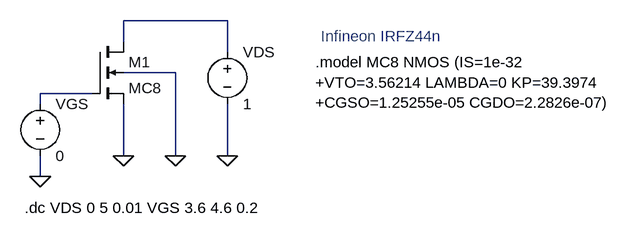
[diagram p0: schematic MOSFET_output.asc]
MOSFET_output.asc, the LTspice schematic file:
Version 4
SHEET 1 1412 680
WIRE 320 80 160 80
WIRE 160 112 160 80
WIRE 320 128 320 80
WIRE 240 160 160 160
WIRE 112 192 32 192
WIRE 32 208 32 192
WIRE 160 288 160 208
WIRE 240 288 240 160
WIRE 320 288 320 208
WIRE 32 320 32 288
FLAG 32 320 0
FLAG 160 288 0
FLAG 320 288 0
FLAG 240 288 0
SYMBOL voltage 32 192 R0
WINDOW 123 0 0 Left 0
WINDOW 39 0 0 Left 0
SYMATTR InstName VGS
SYMATTR Value 0
SYMBOL voltage 320 112 R0
WINDOW 123 0 0 Left 0
WINDOW 39 0 0 Left 0
SYMATTR InstName VDS
SYMATTR Value 1
SYMBOL nmos4 112 112 R0
SYMATTR InstName M1
SYMATTR Value MC8
TEXT 8 368 Left 2 !.dc VDS 0 5 0.01 VGS 3.6 4.6 0.2
TEXT 456 144 Left 2 !.model MC8 NMOS (IS=1e-32\n+VTO=3.56214 LAMBDA=0 KP=39.3974\n+CGSO=1.25255e-05 CGDO=2.2826e-07)
TEXT 464 104 Left 2 ;Infineon IRFZ44n

The netlist it stands for:
* MOSFET_output.asc
VGS N002 0 0
VDS N001 0 1
M1 N001 N002 0 0 MC8
.model NMOS NMOS
.model PMOS PMOS
.lib standard.mos
.dc VDS 0 5 0.01 VGS 3.6 4.6 0.2
.model MC8 NMOS (IS=1e-32
+VTO=3.56214 LAMBDA=0 KP=39.3974
+CGSO=1.25255e-05 CGDO=2.2826e-07)
* Infineon IRFZ44n
.backanno
.end